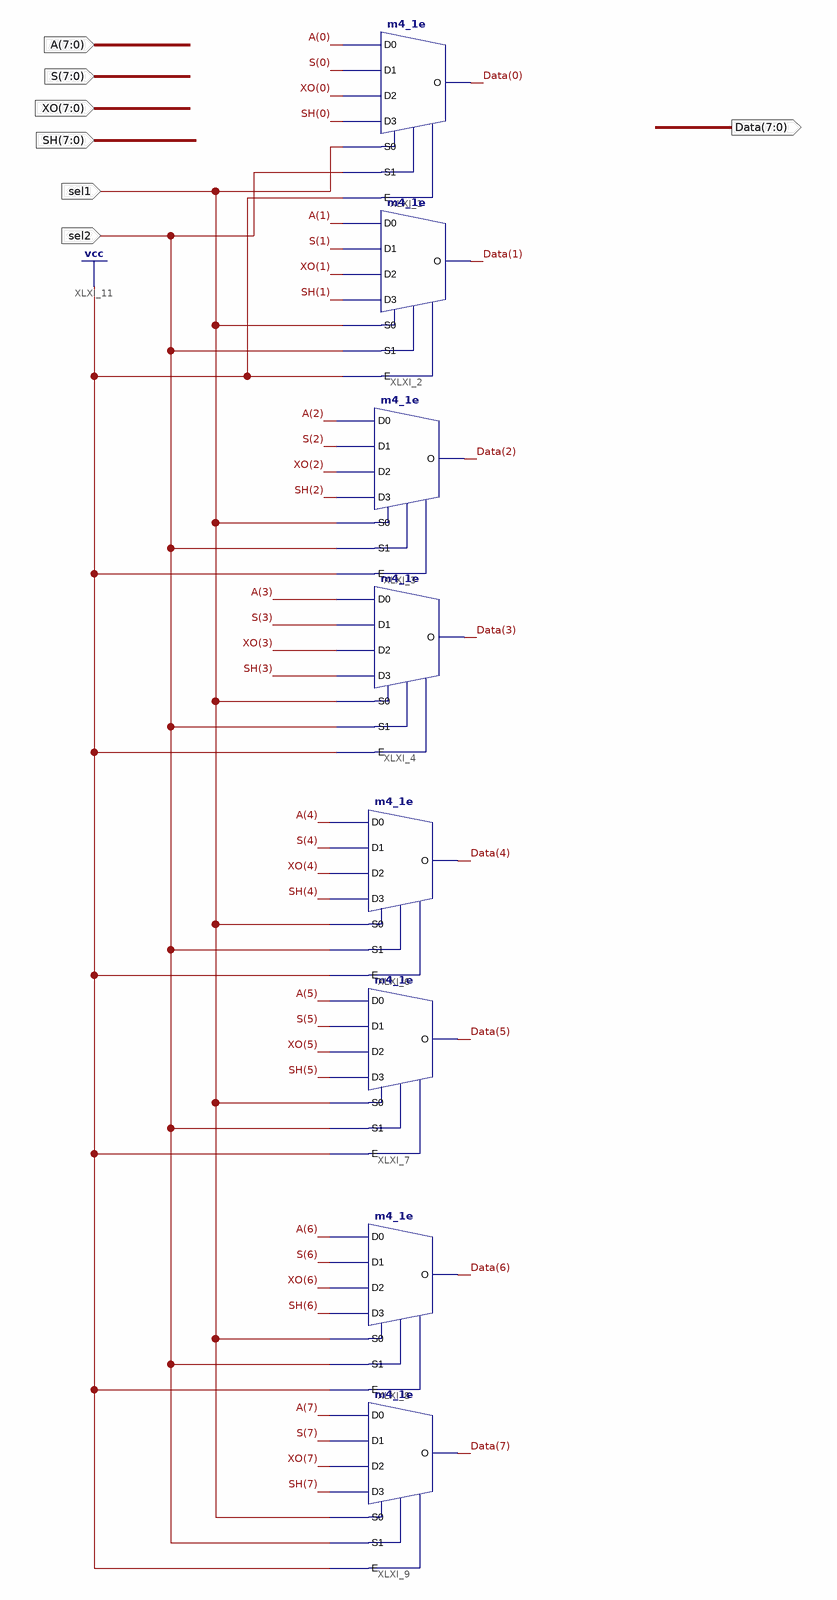
[diagram p0: schematic sheet 1]
// Xilinx ISE schematic sel_data_7sec.sch (spartan6) as structural Verilog: 8 symbols, 7 ports
module sel_data_7sec (
  input  [7:0] A,
  input  [7:0] S,
  input  [7:0] XO,
  input  [7:0] SH,
  input  sel1,
  input  sel2,
  output [7:0] Data
);

  m4_1e XLXI_9 (.D0(A[7]), .D1(S[7]), .D2(XO[7]), .D3(SH[7]), .E(1'b1), .S0(sel1), .S1(sel2), .O(Data[7]));
  m4_1e XLXI_8 (.D0(A[6]), .D1(S[6]), .D2(XO[6]), .D3(SH[6]), .E(1'b1), .S0(sel1), .S1(sel2), .O(Data[6]));
  m4_1e XLXI_7 (.D0(A[5]), .D1(S[5]), .D2(XO[5]), .D3(SH[5]), .E(1'b1), .S0(sel1), .S1(sel2), .O(Data[5]));
  m4_1e XLXI_6 (.D0(A[4]), .D1(S[4]), .D2(XO[4]), .D3(SH[4]), .E(1'b1), .S0(sel1), .S1(sel2), .O(Data[4]));
  m4_1e XLXI_4 (.D0(A[3]), .D1(S[3]), .D2(XO[3]), .D3(SH[3]), .E(1'b1), .S0(sel1), .S1(sel2), .O(Data[3]));
  m4_1e XLXI_3 (.D0(A[2]), .D1(S[2]), .D2(XO[2]), .D3(SH[2]), .E(1'b1), .S0(sel1), .S1(sel2), .O(Data[2]));
  m4_1e XLXI_2 (.D0(A[1]), .D1(S[1]), .D2(XO[1]), .D3(SH[1]), .E(1'b1), .S0(sel1), .S1(sel2), .O(Data[1]));
  m4_1e XLXI_1 (.D0(A[0]), .D1(S[0]), .D2(XO[0]), .D3(SH[0]), .E(1'b1), .S0(sel1), .S1(sel2), .O(Data[0]));
endmodule
